# Altium schematic sheet AudioDSP-1.0_top.SchDoc
size A4; SheetNumber: 1; SheetTotal: 8
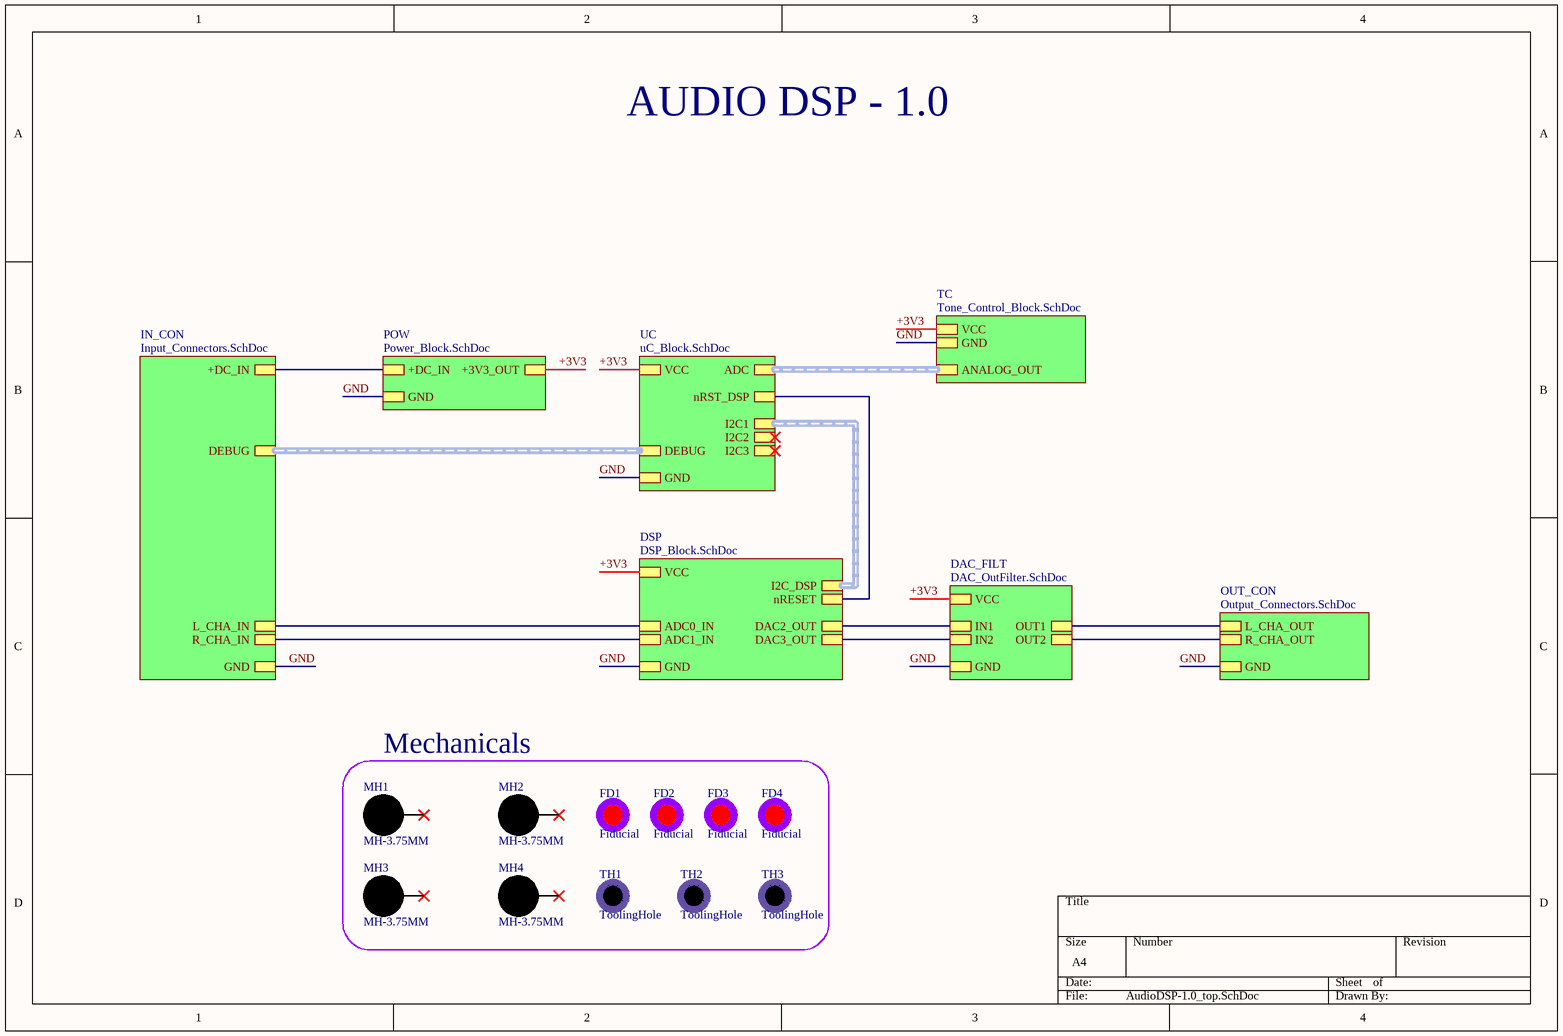
[diagram p0: AudioDSP-1.0_top.SchDoc]

## Parts
FD1  Fiducial  [Fiducial]  (no BOM)
FD2  Fiducial  [Fiducial]  (no BOM)
FD3  Fiducial  [Fiducial]  (no BOM)
FD4  Fiducial  [Fiducial]  (no BOM)
MH1  MH-3.75MM  [MH-3.75mm-NP]  (no BOM)
MH2  MH-3.75MM  [MH-3.75mm-NP]  (no BOM)
MH3  MH-3.75MM  [MH-3.75mm-NP]  (no BOM)
MH4  MH-3.75MM  [MH-3.75mm-NP]  (no BOM)
TH1  ToolingHole  [TOOLING-HOLE]  (no BOM)
TH2  ToolingHole  [TOOLING-HOLE]  (no BOM)
TH3  ToolingHole  [TOOLING-HOLE]  (no BOM)

## Blocks framed on the sheet
Mechanicals: FD1-FD4 MH1-MH4 TH1-TH3

## Sub-sheets
DAC_FILT = DAC_OutFilter.SchDoc: VCC, GND, IN1, IN2, OUT1, OUT2
DSP = DSP_Block.SchDoc: VCC, GND, I2C_DSP (harness I2C_BUS), nRESET, DAC2_OUT, DAC3_OUT, ADC0_IN, ADC1_IN
IN_CON = Input_Connectors.SchDoc: +DC_IN, GND, R_CHA_IN, L_CHA_IN, DEBUG (harness SERIAL_WIRE)
OUT_CON = Output_Connectors.SchDoc: R_CHA_OUT, L_CHA_OUT, GND
POW = Power_Block.SchDoc: +DC_IN, +3V3_OUT, GND
TC = Tone_Control_Block.SchDoc: VCC, GND, ANALOG_OUT (harness ADC_BUS)
UC = uC_Block.SchDoc: VCC, GND, DEBUG (harness SERIAL_WIRE), I2C1 (harness I2C_BUS), I2C2 (harness I2C_BUS), I2C3 (harness I2C_BUS), ADC (harness ADC_BUS), nRST_DSP

## Nets
+3V3: sheet DSP/VCC, sheet DAC_FILT/VCC, sheet POW/+3V3_OUT, sheet UC/VCC, sheet TC/VCC
GND: sheet DSP/GND, sheet DAC_FILT/GND, sheet IN_CON/GND, sheet POW/GND, sheet UC/GND, sheet OUT_CON/GND, sheet TC/GND
(unnamed): sheet DSP/nRESET, sheet UC/nRST_DSP
(unnamed): sheet DSP/DAC2_OUT, sheet DAC_FILT/IN1
(unnamed): sheet DSP/DAC3_OUT, sheet DAC_FILT/IN2
(unnamed): sheet DSP/ADC0_IN, sheet IN_CON/L_CHA_IN
(unnamed): sheet DSP/ADC1_IN, sheet IN_CON/R_CHA_IN
(unnamed): sheet DAC_FILT/OUT1, sheet OUT_CON/L_CHA_OUT
(unnamed): sheet DAC_FILT/OUT2, sheet OUT_CON/R_CHA_OUT
(unnamed): sheet IN_CON/+DC_IN, sheet POW/+DC_IN

Not connected (* = marked no-connect by the designer): MH1 1*; MH2 1*; MH3 1*; MH4 1*

## Buses and harness runs
harness sheet DSP/I2C_DSP = sheet UC/I2C1
harness sheet IN_CON/DEBUG = sheet UC/DEBUG
harness sheet TC/ANALOG_OUT = sheet UC/ADC

## Notes on the sheet
- AUDIO DSP - 1.0

## Library data of the parts
FD1-FD4 = Fiducial: ClassName: Fiducials
MH1-MH4 = MH-3.75MM: ClassName: MountHole
TH1-TH3 = ToolingHole: ClassName: Tooling